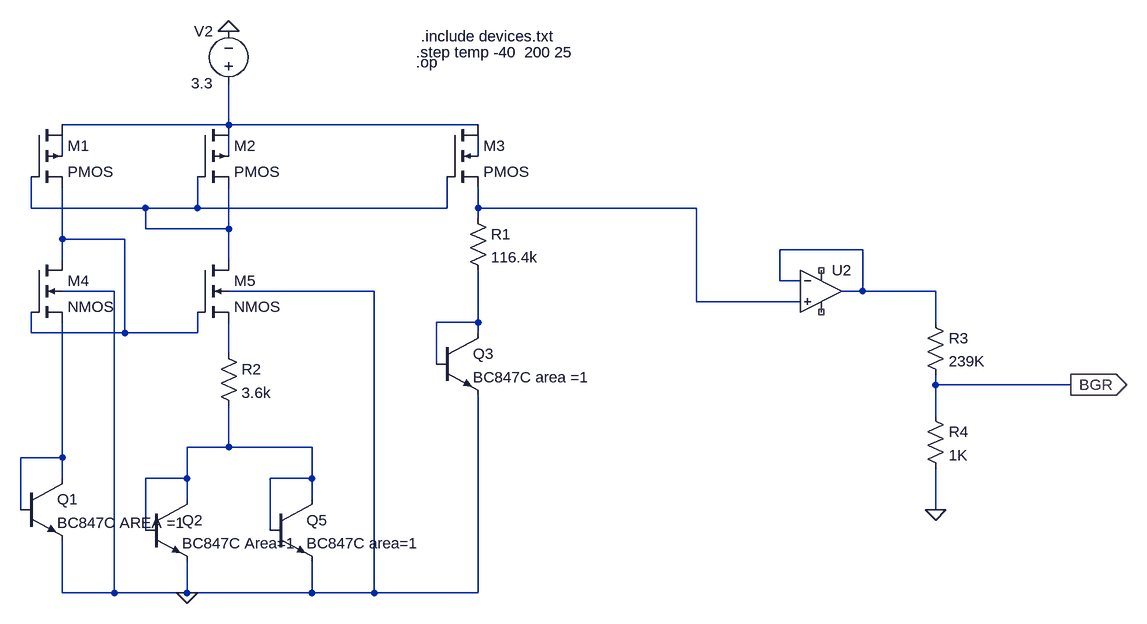
[diagram p0: schematic vref_band.asc]
vref_band.asc, the LTspice schematic file:
Version 4
SHEET 1 2412 896
WIRE 464 160 464 96
WIRE 464 160 208 160
WIRE 848 160 464 160
WIRE 208 208 208 176
WIRE 464 208 464 176
WIRE 848 208 848 176
WIRE 160 288 160 240
WIRE 336 288 160 288
WIRE 416 288 416 240
WIRE 416 288 336 288
WIRE 800 288 800 240
WIRE 800 288 416 288
WIRE 848 288 848 256
WIRE 1184 288 848 288
WIRE 848 304 848 288
WIRE 336 320 336 288
WIRE 464 320 464 256
WIRE 464 320 336 320
WIRE 208 336 208 256
WIRE 304 336 208 336
WIRE 1440 352 1312 352
WIRE 208 368 208 336
WIRE 464 368 464 320
WIRE 1312 400 1312 352
WIRE 1344 400 1312 400
WIRE 288 416 208 416
WIRE 688 416 464 416
WIRE 1440 416 1440 352
WIRE 1440 416 1408 416
WIRE 1552 416 1440 416
WIRE 1184 432 1184 288
WIRE 1344 432 1184 432
WIRE 848 464 848 384
WIRE 848 464 784 464
WIRE 1552 464 1552 416
WIRE 160 480 160 448
WIRE 304 480 304 336
WIRE 304 480 160 480
WIRE 416 480 416 448
WIRE 416 480 304 480
WIRE 848 480 848 464
WIRE 464 512 464 464
WIRE 784 528 784 464
WIRE 1552 560 1552 544
WIRE 1760 560 1552 560
WIRE 1552 608 1552 560
WIRE 464 656 464 592
WIRE 464 656 400 656
WIRE 592 656 464 656
WIRE 208 672 208 464
WIRE 208 672 144 672
WIRE 208 704 208 672
WIRE 400 704 400 656
WIRE 400 704 336 704
WIRE 592 704 592 656
WIRE 592 704 528 704
WIRE 400 736 400 704
WIRE 592 736 592 704
WIRE 144 752 144 672
WIRE 1552 752 1552 688
WIRE 336 784 336 704
WIRE 528 784 528 704
WIRE 208 880 208 800
WIRE 288 880 288 416
WIRE 288 880 208 880
WIRE 400 880 400 832
WIRE 400 880 288 880
WIRE 592 880 592 832
WIRE 592 880 400 880
WIRE 688 880 688 416
WIRE 688 880 592 880
WIRE 848 880 848 576
WIRE 848 880 688 880
FLAG 400 880 0
FLAG 464 16 0
FLAG 1552 752 0
FLAG 1760 560 BGR
IOPIN 1760 560 Out
SYMBOL pmos4 160 160 R0
SYMATTR InstName M1
SYMATTR Value2 m=1
SYMBOL pmos4 416 160 R0
SYMATTR InstName M2
SYMATTR Value2 m=1
SYMBOL nmos4 160 368 R0
SYMATTR InstName M4
SYMATTR Value2 m=1
SYMBOL nmos4 416 368 R0
SYMATTR InstName M5
SYMATTR Value2 m=1
SYMBOL npn 144 704 R0
SYMATTR InstName Q1
SYMATTR Value BC847C AREA =1
SYMBOL npn 336 736 R0
SYMATTR InstName Q2
SYMATTR Value BC847C Area=1
SYMBOL Voltage 464 112 R180
WINDOW 0 24 96 Left 2
WINDOW 3 24 16 Left 2
SYMATTR InstName V2
SYMATTR Value 3.3
SYMBOL Res 832 288 R0
SYMATTR InstName R1
SYMATTR Value 116.4k
SYMBOL Res 448 496 R0
SYMATTR InstName R2
SYMATTR Value 3.6k
SYMBOL npn 528 736 R0
SYMATTR InstName Q5
SYMATTR Value BC847C area=1
SYMBOL nmos4 800 160 R0
SYMATTR InstName M3
SYMATTR Value PMOS
SYMATTR Value2 m=1
SYMBOL npn 784 480 R0
SYMATTR InstName Q3
SYMATTR Value BC847C area =1
SYMBOL Res 1536 448 R0
SYMATTR InstName R3
SYMATTR Value 239K
SYMBOL Res 1536 592 R0
SYMATTR InstName R4
SYMATTR Value 1K
SYMBOL OpAmps/UniversalOpAmp 1376 416 R0
SYMATTR InstName U2
TEXT 752 64 Left 2 !.op
TEXT 752 48 Left 2 !.step temp -40  200 25
TEXT 760 24 Left 2 !.include devices.txt

The netlist it stands for:
* vref_band.asc
M1 N001 N005 N007 N002 PMOS m=1
M2 N001 N005 N005 N003 PMOS m=1
M4 N007 N007 N012 0 NMOS m=1
M5 N005 N007 N010 0 NMOS m=1
Q1 N012 N012 0 0 BC847C AREA =1
Q2 N011 N011 0 0 BC847C Area=1
V2 N001 0 3.3
R1 N006 N009 116.4k
R2 N010 N011 3.6k
Q5 N011 N011 0 0 BC847C area=1
M3 N001 N005 N006 N004 PMOS m=1
Q3 N009 N009 0 0 BC847C area =1
R3 N008 BGR 239K
R4 BGR 0 1K
XU2 N006 N008 NC_01 NC_02 N008 level1 Avol=1Meg GBW=10Meg Vos=0 En=0 Enk=0 In=0 Ink=0 Rin=500Meg  ; pins In+ In- V+ V- OUT
.model NPN NPN
.model PNP PNP
.lib standard.bjt
.model NMOS NMOS
.model PMOS PMOS
.lib standard.mos
.op
.step temp -40  200 25
.include devices.txt
.lib UniversalOpAmp1.lib
.backanno
.end